# EasyEDA Pro project ProPrj_逆变电路（单相三相）_2026-01-25.epro, board PCB5
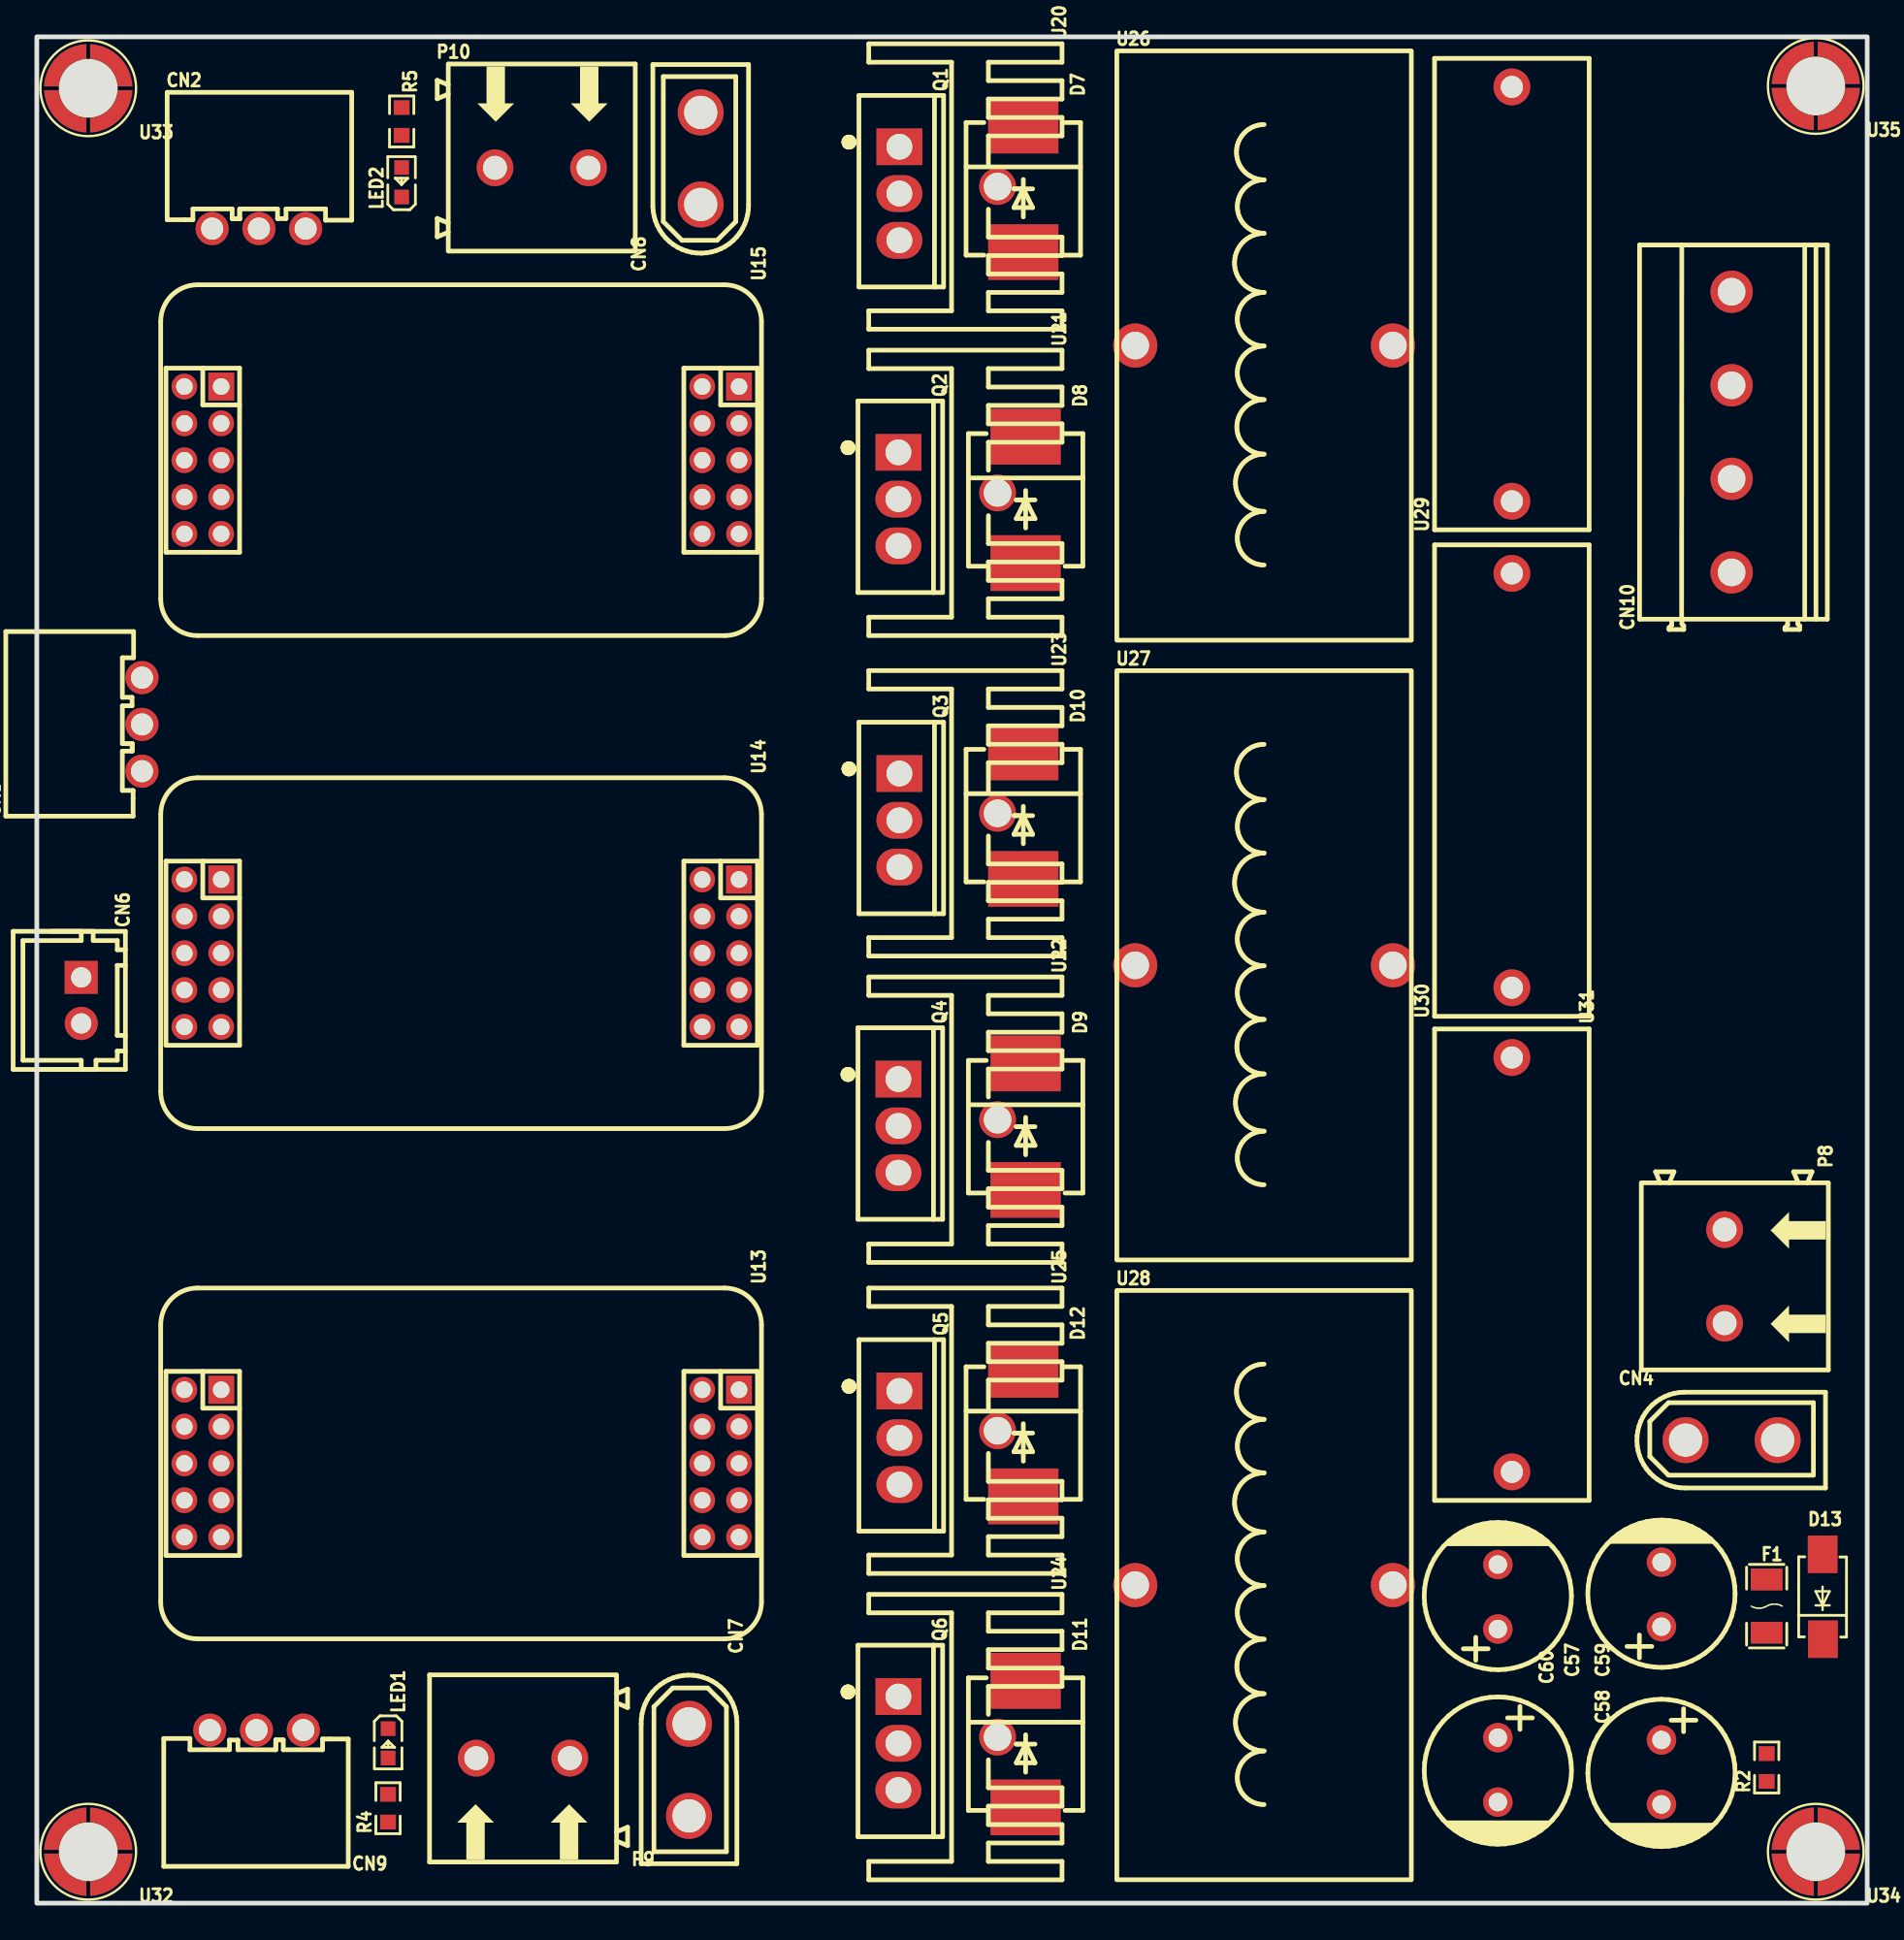
[diagram p3: board, top side]
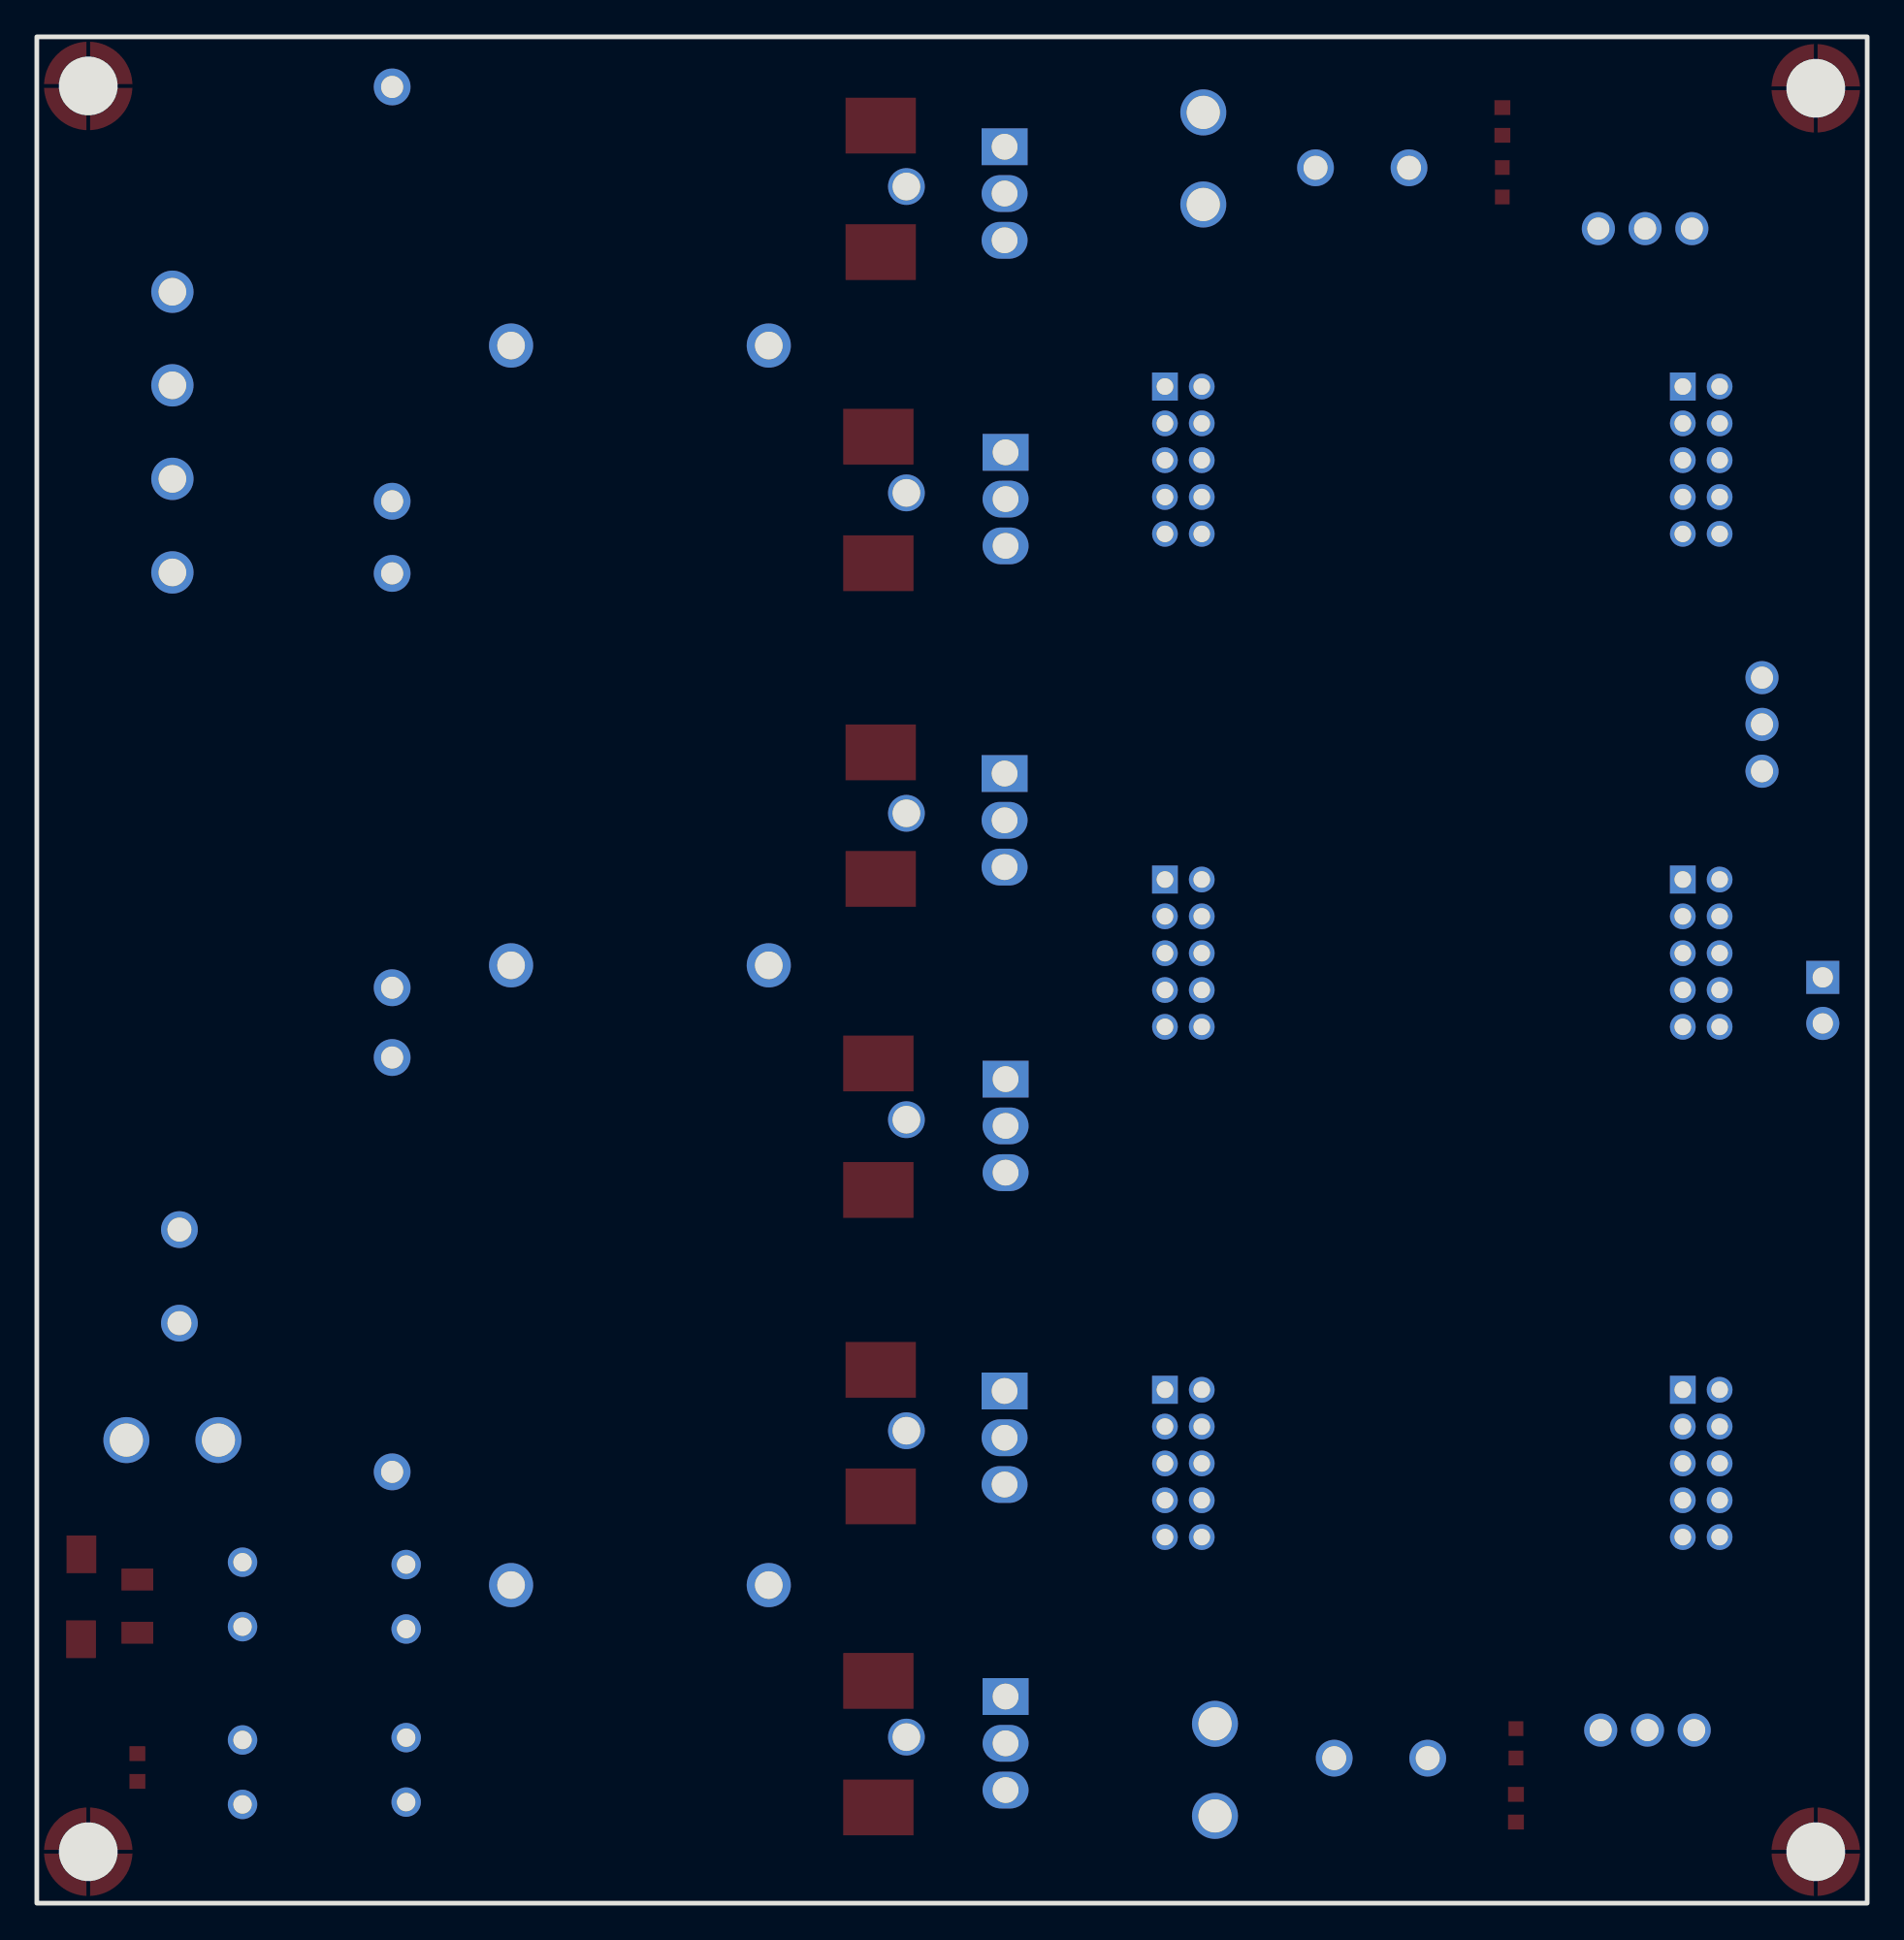
[diagram p4: board, bottom side, seen from below]

Outline 99.44 x 101.35 mm; copper layers: Top Layer, Bottom Layer. Coordinates in mm from the lower left corner of the outline.
Outline path: rectangle 0,101.35 99.44,0
Stack: Top Layer 0.035mm / Dielectric1 1.51mm FR4 er 4.5 / Bottom Layer 0.035mm

## Design rules (mm)
template: JLCPCB Capability(Two Layers Board)
spacing copperThickness1oz (default): track to track 0.102, other pairs 0.152 to 0.3
spacing copperThickness2oz: track to track 0.203, other pairs 0.152 to 0.3
track width copperThickness1oz (default): min 0.127, default 0.254, max 2.54
track width copperThickness2oz: min 0.203, default 0.254, max 2.54
differential pair differentialPair (default): width min 0.127, default 0.254, max 2.54; gap min 0.152, default 0.152
via viaSize (default): diameter min 0.5, default 0.61, max 10; hole min 0.3, default 0.305, max 6.3

## Placement (name value [footprint] x y rotation side)
C57  470uF  [CAP-TH_BD8.0-P3.50-D0.6-FD_1]  88.26 16.76 90 top
C58  470uF  [CAP-TH_BD8.0-P3.50-D0.6-FD_1]  88.26 7.11 270 top
C59  470uF  [CAP-TH_BD8.0-P3.50-D0.6-FD_1]  79.38 16.64 90 top
C60  470uF  [CAP-TH_BD8.0-P3.50-D0.6-FD_1]  79.38 7.24 270 top
CN2  XH-3AW  [CONN-TH_3P-P2.54_HCTL_XH-3AW]  12.06 90.93 0 top
CN3  XH-3AW  [CONN-TH_3P-P2.54_HCTL_XH-3AW]  5.72 64.01 90 top
CN4  XT30UPB-M  [CONN-TH_XT30UPB-M]  92.07 25.15 0 top
CN6  ZX-XH2.54-2PZZ  [CONN-TH_2P-P2.50_HX25003-2A]  2.41 49.02 270 top
CN7  XT30UPB-M  [CONN-TH_XT30UPB-M]  35.43 7.24 270 top
CN8  XT30UPB-M  [CONN-TH_XT30UPB-M]  36.07 94.74 90 top
CN9  XH-3AW  [CONN-TH_3P-P2.54_HCTL_XH-3AW]  11.94 9.4 180 top
CN10  DB128V-5.08-4P-GN-S  [CONN-TH_4P-P5.08_DIBO_DB128V-5.08]  92.07 79.88 90 top
D7  SS510  [SMC_L7.1-W6.2-LS8.1-R-RD]  53.59 93.09 270 top
D8  SS510  [SMC_L7.1-W6.2-LS8.1-R-RD]  53.72 76.2 270 top
D9  SS510  [SMC_L7.1-W6.2-LS8.1-R-RD]  53.72 42.16 270 top
D10  SS510  [SMC_L7.1-W6.2-LS8.1-R-RD]  53.59 59.06 270 top
D11  SS510  [SMC_L7.1-W6.2-LS8.1-R-RD]  53.72 8.64 270 top
D12  SS510  [SMC_L7.1-W6.2-LS8.1-R-RD]  53.59 25.53 270 top
D13  SS54  [SMA_L4.3-W2.6-LS5.0-FD]  97.03 16.64 270 top
F1  JFC1206-1500FS  [F1206]  93.98 16.13 270 top
LED1  LTST-C190KSKT  [LED0603-RD]  19.08 8.68 270 top
LED2  LTST-C190KSKT  [LED0603-RD]  19.82 93.45 90 top
P8  WJ500V-5.08-2P  [CONN-TH_2P-P5.00_WJ500V-5.08-2P]  91.69 34.04 270 top
P9  WJ500V-5.08-2P  [CONN-TH_2P-P5.00_WJ500V-5.08-2P]  26.42 7.87 180 top
P10  WJ500V-5.08-2P  [CONN-TH_2P-P5.00_WJ500V-5.08-2P]  27.43 94.23 0 top
Q1  IRF540  [TO-220AB-3_L10.4-W4.6-P2.54-L]  46.86 92.84 270 top
Q2  IRF540  [TO-220AB-3_L10.4-W4.6-P2.54-L]  46.81 76.24 270 top
Q3  IRF540  [TO-220AB-3_L10.4-W4.6-P2.54-L]  46.86 58.8 270 top
Q4  IRF540  [TO-220AB-3_L10.4-W4.6-P2.54-L]  46.81 42.21 270 top
Q5  IRF540  [TO-220AB-3_L10.4-W4.6-P2.54-L]  46.86 25.27 270 top
Q6  IRF540  [TO-220AB-3_L10.4-W4.6-P2.54-L]  46.81 8.68 270 top
R2  100kΩ  [R0603]  93.98 7.37 90 top
R4  5kΩ  [R0603]  19.08 5.16 90 top
R5  5kΩ  [R0603]  19.82 96.75 270 top
U13  -  [UCC21520模块]  24.26 23.73 270 top
U14  -  [UCC21520模块]  24.26 51.44 270 top
U15  -  [UCC21520模块]  24.26 78.21 270 top
U20  15.5*10.5*21  [SINK-TH_L15.0-W10.5-H21.0]  52.2 93.22 270 top
U21  15.5*10.5*21  [SINK-TH_L15.0-W10.5-H21.0]  52.2 76.58 270 top
U22  15.5*10.5*21  [SINK-TH_L15.0-W10.5-H21.0]  52.2 42.55 270 top
U23  15.5*10.5*21  [SINK-TH_L15.0-W10.5-H21.0]  52.2 59.18 270 top
U24  15.5*10.5*21  [SINK-TH_L15.0-W10.5-H21.0]  52.2 9.02 270 top
U25  15.5*10.5*21  [SINK-TH_L15.0-W10.5-H21.0]  52.2 25.65 270 top
U26  -  [L_P14MM]  66.68 84.58 0 top
U27  -  [L_P14MM]  66.68 50.93 0 top
U28  -  [L_P14MM]  66.68 17.27 0 top
U29  4.7uF  [CAP-TH_L25.5-W8.4-P22.50-D0.8]  80.14 87.38 90 top
U30  4.7uF  [CAP-TH_L25.5-W8.4-P22.50-D0.8]  80.14 60.96 90 top
U31  4.7uF  [CAP-TH_L25.5-W8.4-P22.50-D0.8]  80.14 34.67 270 top
U32  M3x10+6Cu  [SMD_L4.7-W4.7-D3.0]  2.79 2.79 180 top
U33  M3x10+6Cu  [SMD_L4.7-W4.7-D3.0]  2.79 98.55 180 top
U34  M3x10+6Cu  [SMD_L4.7-W4.7-D3.0]  96.65 2.79 180 top
U35  M3x10+6Cu  [SMD_L4.7-W4.7-D3.0]  96.65 98.68 180 top

## Footprints (pads in the part's own frame, mm; a bottom-side part is the same pattern mirrored in y, then rotated)
CAP-TH_BD8.0-P3.50-D0.6-FD_1
  round 1.6 hole 1: 1(-1.75,0) 2(1.75,0)
CAP-TH_L25.5-W8.4-P22.50-D0.8
  round 2 hole 1.2: 1(-11.25,0) 2(11.25,0)
CONN-TH_2P-P2.50_HX25003-2A
  rect 1.8x1.8 hole 1.1: 1(-1.25,0)
  round 1.8 hole 1.1: 2(1.25,0)
CONN-TH_2P-P5.00_WJ500V-5.08-2P
  round 2 hole 1.3: 1(-2.54,0) 2(2.54,0)
CONN-TH_3P-P2.54_HCTL_XH-3AW
  round 1.8 hole 1.199: 1(-2.54,0) 2(0.002,0) 3(2.54,0)
CONN-TH_4P-P5.08_DIBO_DB128V-5.08
  round 2.3 hole 1.5: 1(-7.62,0) 2(-2.54,0) 3(2.54,0) 4(7.62,0)
CONN-TH_XT30UPB-M
  round 2.5 hole 1.8: 1(-2.5,0) 2(2.5,0)
F1206
  rect 1.19x1.728 smd: 1(-1.445,0) 2(1.445,0)
L_P14MM
  round 2.4 hole 1.5: 1(-7,0) 2(7,0)
LED0603-RD
  rect 0.8x0.8 smd: 1(-0.799,0) 2(0.799,0)
R0603
  rect 0.806x0.864 smd: 1(-0.753,0) 2(0.753,0)
SINK-TH_L15.0-W10.5-H21.0
  round 2 hole 1.5: 1(0,0)
SMA_L4.3-W2.6-LS5.0-FD
  rect 2.046x1.62 smd: 1(-2.304,-0.009) 2(2.304,0.009)
SMC_L7.1-W6.2-LS8.1-R-RD
  rect 3.03x3.82 smd: 1(3.435,0) 2(-3.435,0)
SMD_L4.7-W4.7-D3.0
  custom 2.3x2.3 smd: 1(-1.25,-1.528) 1(-1.25,1.528) 1(1.25,1.528) 1(1.25,-1.528)
TO-220AB-3_L10.4-W4.6-P2.54-L
  rect 2x2.5 hole 1.4: 1(-2.54,0)
  oval 2x2.5 hole 1.4: 2(0,0) 3(2.54,0)
UCC21520模块
  rect 1.524x1.4 hole 0.9: 1(-4.151,-14.24) 6(-4.151,13.895)
  round 1.4 hole 0.9: 1(-4.151,-16.24) 2(-2.151,-14.24) 2(-2.151,-16.24) 3(-0.151,-14.24) 3(-0.151,-16.24) 4(1.849,-14.24) 4(1.849,-16.24) 5(3.849,-14.24) 5(3.849,-16.24) 6(-4.151,11.895) 7(-2.151,13.895) 7(-2.151,11.895) 8(-0.151,13.895) 8(-0.151,11.895) 9(1.849,13.895) 9(1.849,11.895) 10(3.849,13.895) 10(3.849,11.895)

## Nets
+5V: CN8.2 P10.2 R5.1 U13.3 U14.3 U15.3
+12V: CN7.2 P9.2 R4.1 U13.10 U14.10 U15.10
AGND: CN2.3 CN3.3 CN6.2 CN8.1 CN9.3 LED2.1 P10.1 U13.5 U14.5 U15.5 U32.1 U33.1
PGND: C57.2 C58.2 C59.2 C60.2 CN4.1 CN7.1 D8.1 D9.1 D11.1 D13.1 LED1.1 P8.1 P9.1 Q2.3 Q4.3 Q6.3 R2.1 U13.9 U14.9 U15.9 U20.1 U21.1 U22.1 U23.1 U24.1 U25.1 U34.1 U35.1
DIS: CN6.1 U13.4 U14.4 U15.4
IN1+: C57.1 C58.1 C59.1 C60.1 D7.2 D10.2 D12.2 D13.2 F1.2 Q1.2 Q3.2 Q5.2 R2.2
IN+: CN4.2 F1.1 P8.2
OUTA: Q1.1 U15.6
OUTB: Q2.1 U15.8
OUTC: Q3.1 U14.6
OUTD: Q4.1 U14.8
OUTE: Q5.1 U13.6
OUTF: Q6.1 U13.8
PWMA: CN2.1 U15.1
PWMB: CN2.2 U15.2
PWMC: CN3.1 U14.1
PWMD: CN3.2 U14.2
PWME: CN9.1 U13.1
PWMF: CN9.2 U13.2
UA: CN10.4 U26.2 U29.1
UB: CN10.3 U27.2 U30.1
UC: CN10.2 U28.2 U31.1
UN: CN10.1 U29.2 U30.2 U31.2
VS1: D7.1 D8.2 Q1.3 Q2.2 U15.7 U26.1
VS2: D9.2 D10.1 Q3.3 Q4.2 U14.7 U27.1
VS3: D11.2 D12.1 Q5.3 Q6.2 U13.7 U28.1
$1N1622: LED1.2 R4.2
$1N1626: LED2.2 R5.2
